# Altium schematic sheet Current_sensors.SchDoc
size A1; SheetNumber: 1; SheetTotal: 1
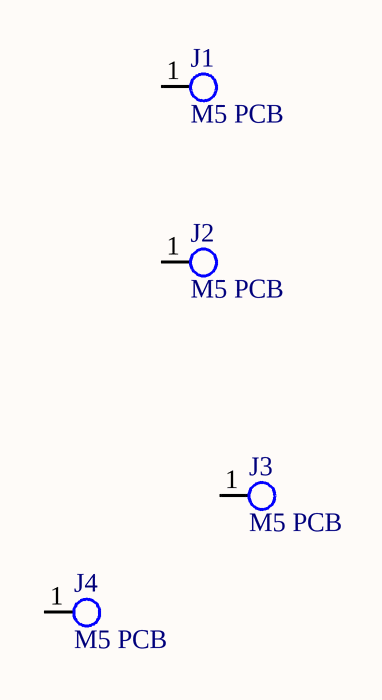
[diagram p0: Current_sensors.SchDoc]

## Parts
J1  M5 PCB  [M5_Conn]
J2  M5 PCB  [M5_Conn]
J3  M5 PCB  [M5_Conn]
J4  M5 PCB  [M5_Conn]

## Nets

Not connected (* = marked no-connect by the designer): J1 1(0); J2 1(0); J3 1(0); J4 1(0)

## Library data of the parts
J1-J4 = Klema_15_A